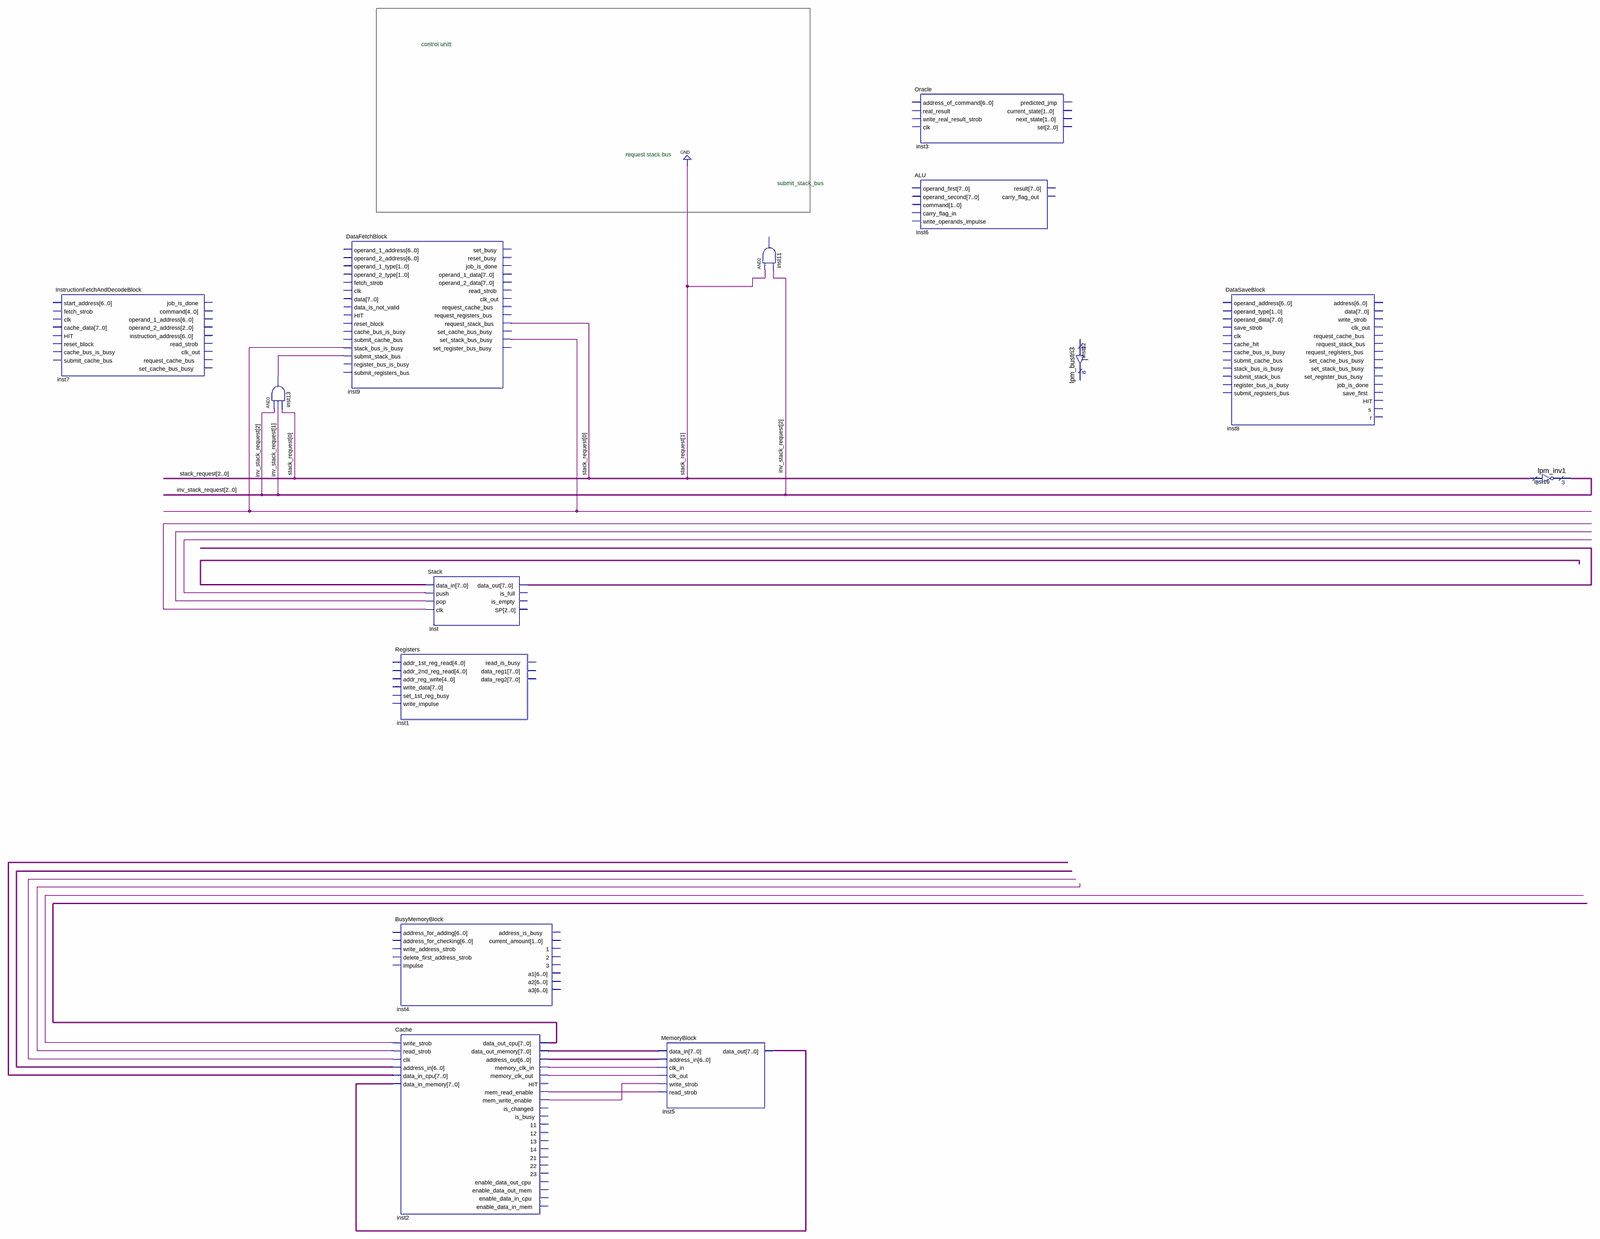
[diagram p0: schematic sheet, whole]
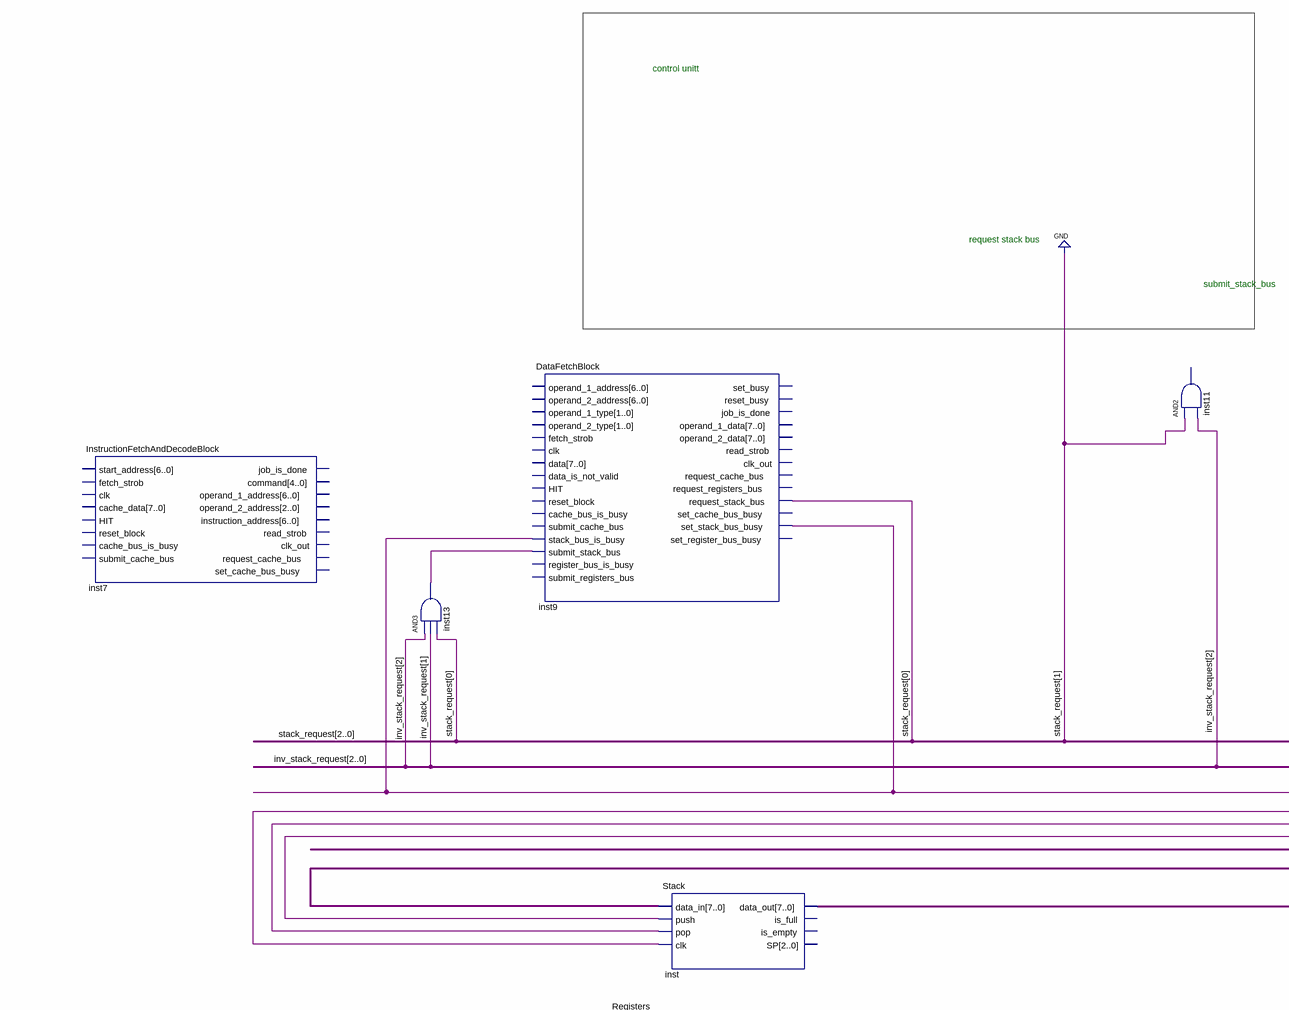
[diagram p1: schematic sheet, upper left part]
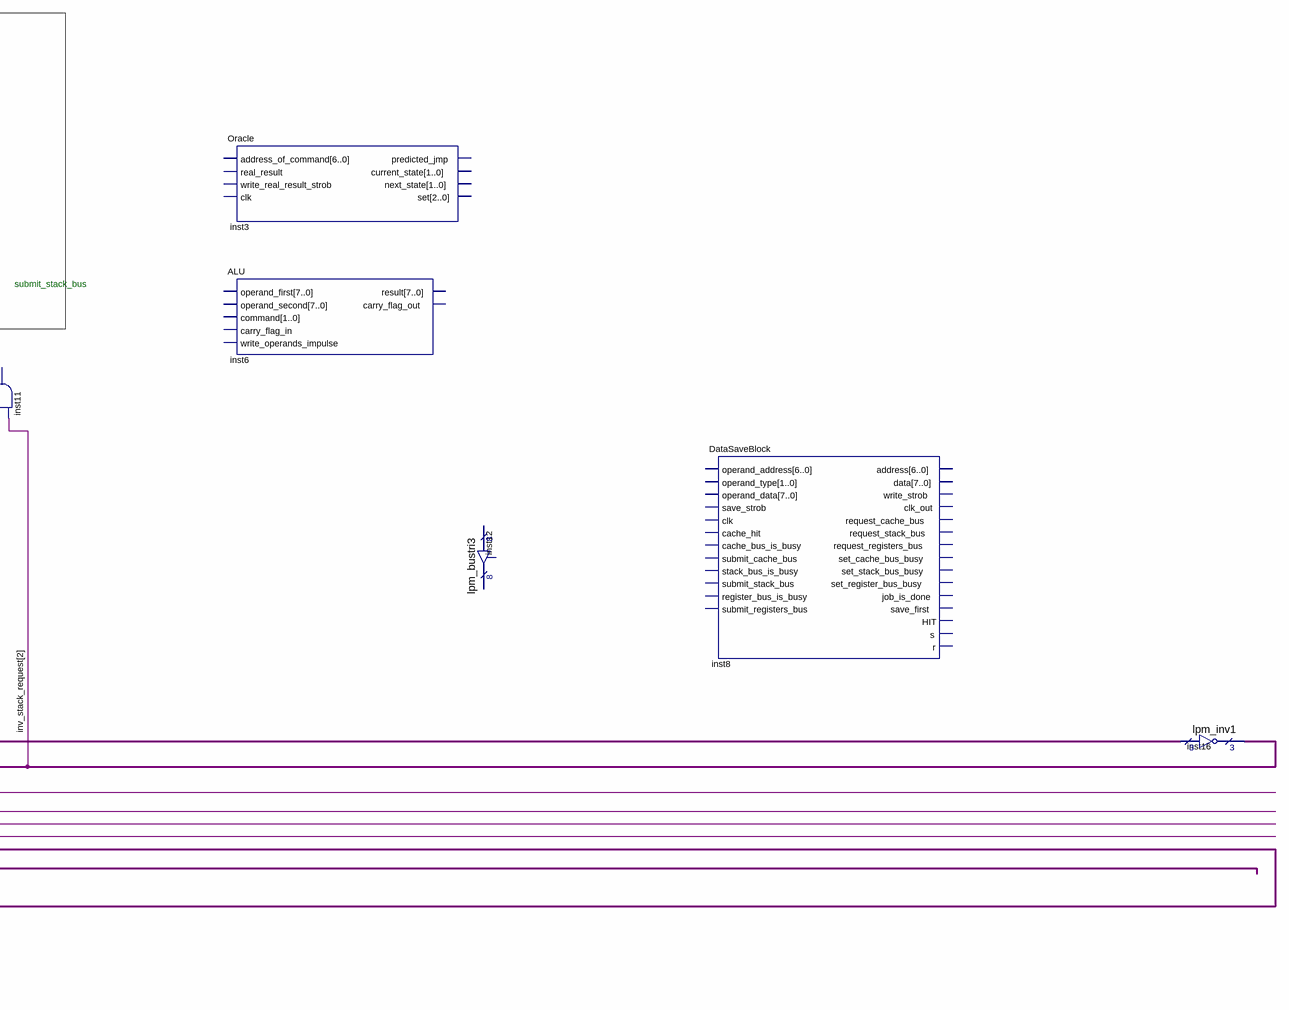
[diagram p2: schematic sheet, upper right part]
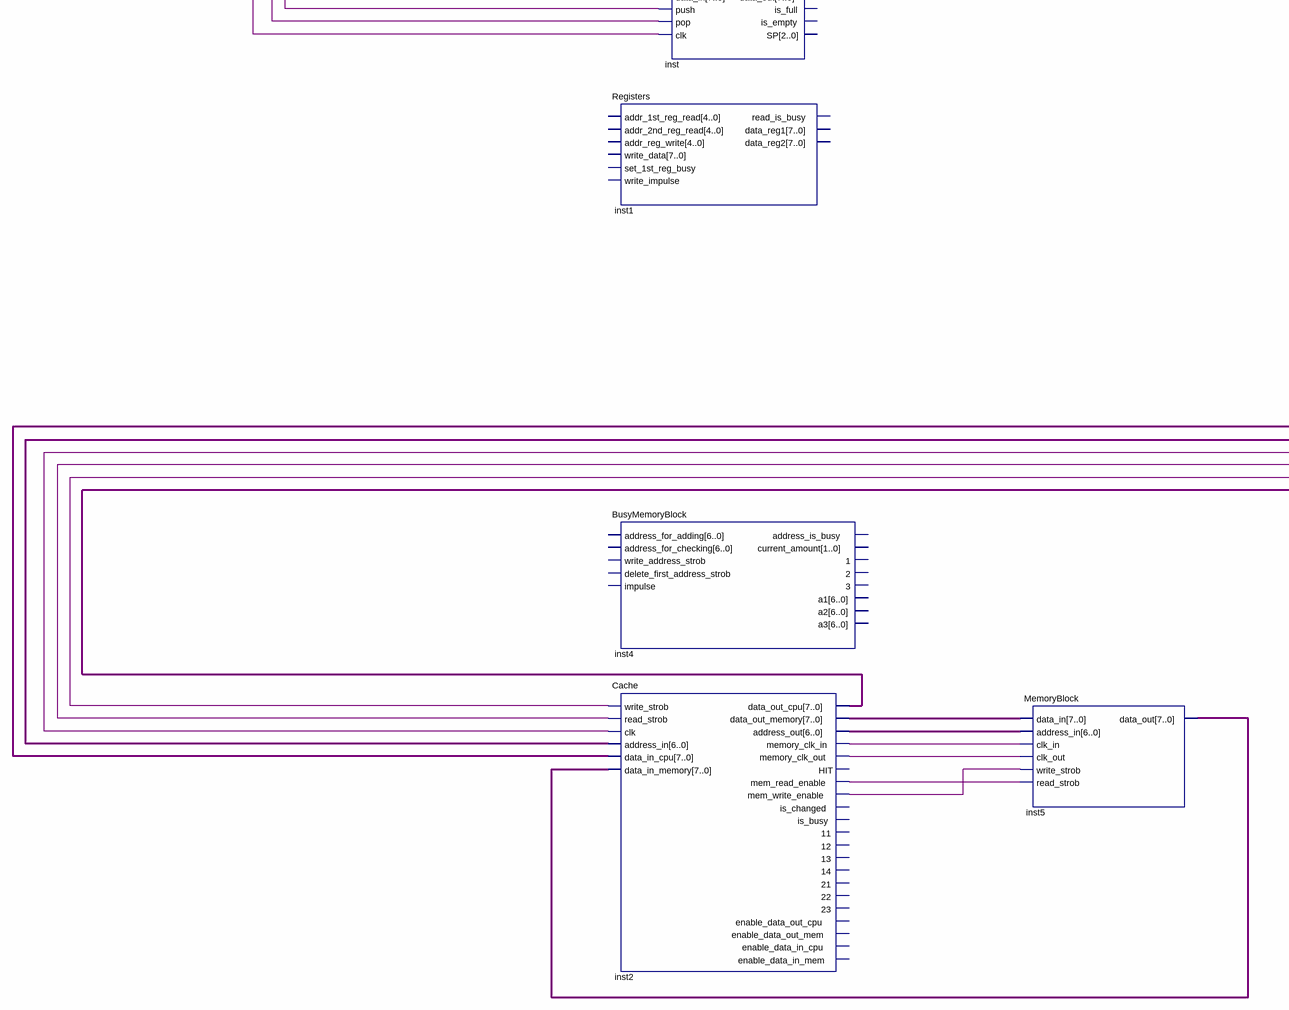
[diagram p3: schematic sheet, lower left part]
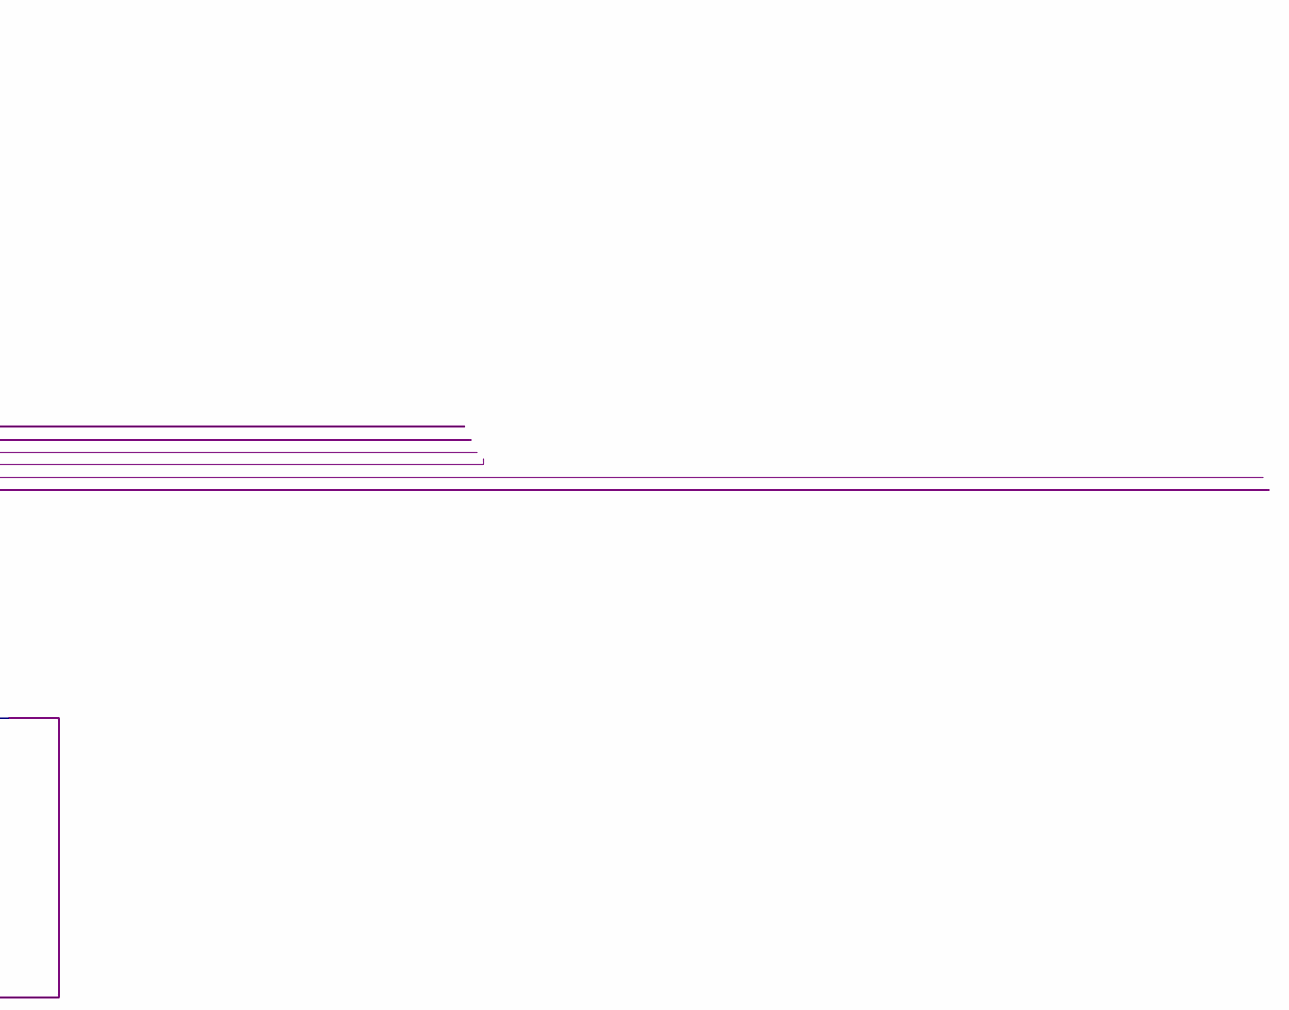
[diagram p4: schematic sheet, lower right part]
// Quartus schematic CourseProject.bdf as structural Verilog: 14 symbols, 0 pins
module CourseProject (
);

  wire inst2_mem_read_enable, inst2_mem_write_enable, inst2_memory_clk_in, inst2_memory_clk_out,
       inst9_set_stack_bus_busy, inst13_out, undriven, undriven_2, undriven_3, undriven_5, undriven_6,
       undriven_7;
  wire [2:0] inv_stack_request, stack_request;
  wire [6:0] inst2_address_out, undriven_8;
  wire [7:0] inst2_data_out_cpu, inst2_data_out_memory, inst5_data_out, inst_data_out, undriven_4, undriven_9;

  InstructionFetchAndDecodeBlock inst7 ();  // open: start_address, fetch_strob, clk, cache_data, HIT, reset_block, cache_bus_is_busy, submit_cache_bus, job_is_done, command, operand_1_address, operand_2_address, instruction_address, read_strob, clk_out, request_cache_bus, set_cache_bus_busy
  and inst13 (inst13_out, inv_stack_request[2], inv_stack_request[1], stack_request[0]);
  DataFetchBlock inst9 (
    .stack_bus_is_busy(inst9_set_stack_bus_busy), .submit_stack_bus(inst13_out),
    .request_stack_bus(stack_request[0]), .set_stack_bus_busy(inst9_set_stack_bus_busy));  // open: operand_1_address, operand_2_address, operand_1_type, operand_2_type, fetch_strob, clk, data, data_is_not_valid, HIT, reset_block, cache_bus_is_busy, submit_cache_bus, register_bus_is_busy, submit_registers_bus, set_busy, reset_busy, job_is_done, operand_1_data, operand_2_data, read_strob, clk_out, request_cache_bus, request_registers_bus, set_cache_bus_busy, set_register_bus_busy
  Registers inst1 ();  // open: addr_1st_reg_read, addr_2nd_reg_read, addr_reg_write, write_data, set_1st_reg_busy, write_impulse, read_is_busy, data_reg1, data_reg2
  BusyMemoryBlock inst4 ();  // open: address_for_adding, address_for_checking, write_address_strob, delete_first_address_strob, impulse, address_is_busy, current_amount, 1, 2, 3, a1, a2, a3
  Cache inst2 (
    .write_strob(undriven_5), .read_strob(undriven_6), .clk(undriven_7), .address_in(undriven_8),
    .data_in_cpu(undriven_9), .data_in_memory(inst5_data_out), .data_out_cpu(inst2_data_out_cpu),
    .data_out_memory(inst2_data_out_memory), .address_out(inst2_address_out),
    .memory_clk_in(inst2_memory_clk_in), .memory_clk_out(inst2_memory_clk_out),
    .mem_read_enable(inst2_mem_read_enable), .mem_write_enable(inst2_mem_write_enable));  // open: HIT, is_changed, is_busy, 11, 12, 13, 14, 21, 22, 23, enable_data_out_cpu, enable_data_out_mem, enable_data_in_cpu, enable_data_in_mem
  Stack inst (
    .data_in(undriven_4), .push(undriven_3), .pop(undriven_2), .clk(undriven), .data_out(inst_data_out));  // open: is_full, is_empty, SP
  MemoryBlock inst5 (
    .data_in(inst2_data_out_memory), .address_in(inst2_address_out), .clk_in(inst2_memory_clk_in),
    .clk_out(inst2_memory_clk_out), .write_strob(inst2_mem_write_enable), .read_strob(inst2_mem_read_enable),
    .data_out(inst5_data_out));
  // AND2 inst11 has open pins: IN1=1'b0, IN2=inv_stack_request[2], OUT=open
  Oracle inst3 ();  // open: address_of_command, real_result, write_real_result_strob, clk, predicted_jmp, current_state, next_state, set
  ALU inst6 ();  // open: operand_first, operand_second, command, carry_flag_in, write_operands_impulse, result, carry_flag_out
  lpm_bustri3 inst12 ();  // open: enabledt, data, tridata
  DataSaveBlock inst8 ();  // open: operand_address, operand_type, operand_data, save_strob, clk, cache_hit, cache_bus_is_busy, submit_cache_bus, stack_bus_is_busy, submit_stack_bus, register_bus_is_busy, submit_registers_bus, address, data, write_strob, clk_out, request_cache_bus, request_stack_bus, request_registers_bus, set_cache_bus_busy, set_stack_bus_busy, set_register_bus_busy, job_is_done, save_first, HIT, s, r
  lpm_inv1 inst16 (.data({stack_request[2], 1'b0, stack_request[0]}), .result(inv_stack_request));

  // Notes on the sheet:
  //   control unitt
  //   request stack bus
  //   submit_stack_bus
endmodule
